# EAGLE schematic GaN_Fet_ESC_V0.1 (EAGLE 9.6.0)

## Sheet 1 of 2: Power Stage
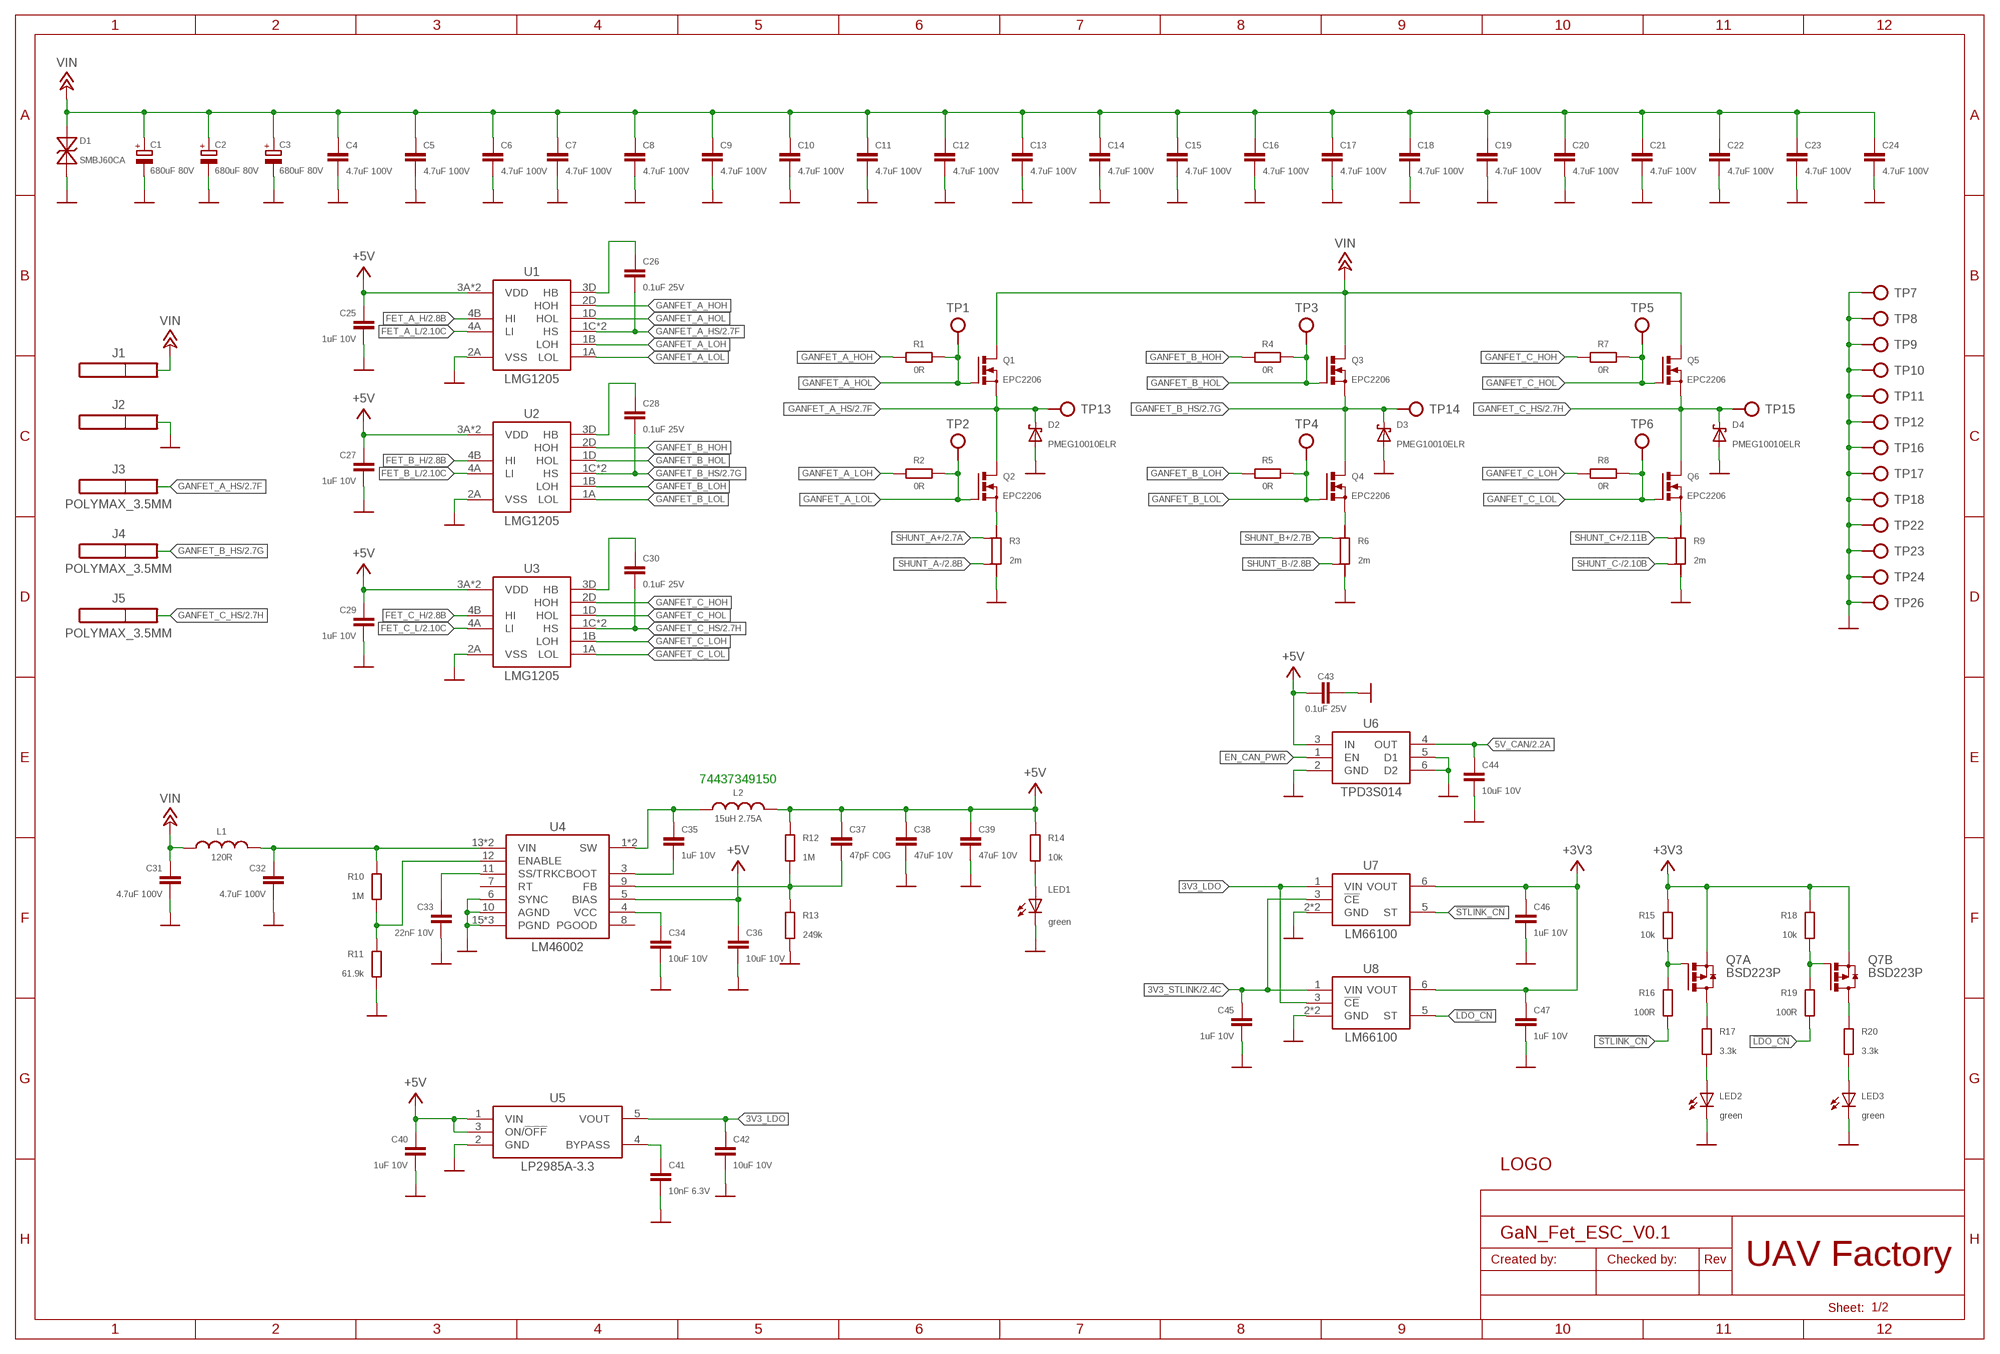
[diagram p0: schematic, sheet 1]

### Parts
C1  680uF 80V  CAPACITOR_ELECTROLYTIC1  [C_7.50_16_26.5_1]
C2  680uF 80V  CAPACITOR_ELECTROLYTIC2  [C_7.50_16_26.5_2]
C3  680uF 80V  CAPACITOR_ELECTROLYTIC3  [C_7.50_16_26.5_3]
C4  4.7uF 100V  CAPACITOR_CERAMIC/1210  [C1210]
C5  4.7uF 100V  CAPACITOR_CERAMIC/1210  [C1210]
C6  4.7uF 100V  CAPACITOR_CERAMIC/1210  [C1210]
C7  4.7uF 100V  CAPACITOR_CERAMIC/1210  [C1210]
C8  4.7uF 100V  CAPACITOR_CERAMIC/1210  [C1210]
C9  4.7uF 100V  CAPACITOR_CERAMIC/1210  [C1210]
C10  4.7uF 100V  CAPACITOR_CERAMIC/1210  [C1210]
C11  4.7uF 100V  CAPACITOR_CERAMIC/1210  [C1210]
C12  4.7uF 100V  CAPACITOR_CERAMIC/1210  [C1210]
C13  4.7uF 100V  CAPACITOR_CERAMIC/1210  [C1210]
C14  4.7uF 100V  CAPACITOR_CERAMIC/1210  [C1210]
C15  4.7uF 100V  CAPACITOR_CERAMIC/1210  [C1210]
C16  4.7uF 100V  CAPACITOR_CERAMIC/1210  [C1210]
C17  4.7uF 100V  CAPACITOR_CERAMIC/1210  [C1210]
C18  4.7uF 100V  CAPACITOR_CERAMIC/1210  [C1210]
C19  4.7uF 100V  CAPACITOR_CERAMIC/1210  [C1210]
C20  4.7uF 100V  CAPACITOR_CERAMIC/1210  [C1210]
C21  4.7uF 100V  CAPACITOR_CERAMIC/1210  [C1210]
C22  4.7uF 100V  CAPACITOR_CERAMIC/1210  [C1210]
C23  4.7uF 100V  CAPACITOR_CERAMIC/1210  [C1210]
C24  4.7uF 100V  CAPACITOR_CERAMIC/1210  [C1210]
C25  1uF 10V  CAPACITOR_CERAMIC/0402  [C0402]
C26  0.1uF 25V  CAPACITOR_CERAMIC/0402  [C0402]
C27  1uF 10V  CAPACITOR_CERAMIC/0402  [C0402]
C28  0.1uF 25V  CAPACITOR_CERAMIC/0402  [C0402]
C29  1uF 10V  CAPACITOR_CERAMIC/0402  [C0402]
C30  0.1uF 25V  CAPACITOR_CERAMIC/0402  [C0402]
C31  4.7uF 100V  CAPACITOR_CERAMIC/1210  [C1210]
C32  4.7uF 100V  CAPACITOR_CERAMIC/1210  [C1210]
C33  22nF 10V  CAPACITOR_CERAMIC/0402  [C0402]
C34  10uF 10V  CAPACITOR_CERAMIC/0603  [C0603]
C35  1uF 10V  CAPACITOR_CERAMIC/0402  [C0402]
C36  10uF 10V  CAPACITOR_CERAMIC/0603  [C0603]
C37  47pF C0G  CAPACITOR_CERAMIC/0402  [C0402]
C38  47uF 10V  CAPACITOR_CERAMIC/1206  [C1206]
C39  47uF 10V  CAPACITOR_CERAMIC/1206  [C1206]
C40  1uF 10V  CAPACITOR_CERAMIC/0402  [C0402]
C41  10nF 6.3V  CAPACITOR_CERAMIC/0402  [C0402]
C42  10uF 10V  CAPACITOR_CERAMIC/0603  [C0603]
C43  0.1uF 25V  CAPACITOR_CERAMIC/0402  [C0402]
C44  10uF 10V  CAPACITOR_CERAMIC/0603  [C0603]
C45  1uF 10V  CAPACITOR_CERAMIC/0402  [C0402]
C46  1uF 10V  CAPACITOR_CERAMIC/0402  [C0402]
C47  1uF 10V  CAPACITOR_CERAMIC/0402  [C0402]
D1  SMBJ60CA  DIODE_TVS_BIDIR/SMB  [DO214AA(SMB)]
D2  PMEG10010ELR  DIODE_SCHOTTKY/SOD123  [SOD123F]
D3  PMEG10010ELR  DIODE_SCHOTTKY/SOD123  [SOD123F]
D4  PMEG10010ELR  DIODE_SCHOTTKY/SOD123  [SOD123F]
J1  PIN_14X10  [4X10SMD]
J2  PIN_14X10  [4X10SMD]
J3  POLYMAX_3.5MM  [POLYMAX_3.5MM]
J4  POLYMAX_3.5MM  [POLYMAX_3.5MM]
J5  POLYMAX_3.5MM  [POLYMAX_3.5MM]
L1  120R  INDUCTOR/1206  [L1206]
L2  15uH 2.75A  INDUCTOR/WE-LHMI  [WURTH_6.6X6.6]
LED1  green  LED/0603  [CHIP-LED0603]
LED2  green  LED/0603  [CHIP-LED0603]
LED3  green  LED/0603  [CHIP-LED0603]
Q1  EPC2206  GAN-N-FET  [EPC2206]
Q2  EPC2206  GAN-N-FET  [EPC2206]
Q3  EPC2206  GAN-N-FET  [EPC2206]
Q4  EPC2206  GAN-N-FET  [EPC2206]
Q5  EPC2206  GAN-N-FET  [EPC2206]
Q6  EPC2206  GAN-N-FET  [EPC2206]
Q7  BSD223P  P-FET  [SC-70-6]
R1  0R  RESISTOR_SMD/0402  [R0402]
R2  0R  RESISTOR_SMD/0402  [R0402]
R3  2m  RESISTOR_KELVIN/CRF2512  [CSS2H-2512]
R4  0R  RESISTOR_SMD/0402  [R0402]
R5  0R  RESISTOR_SMD/0402  [R0402]
R6  2m  RESISTOR_KELVIN/CRF2512  [CSS2H-2512]
R7  0R  RESISTOR_SMD/0402  [R0402]
R8  0R  RESISTOR_SMD/0402  [R0402]
R9  2m  RESISTOR_KELVIN/CRF2512  [CSS2H-2512]
R10  1M  RESISTOR_SMD/0603  [R0603]
R11  61.9k  RESISTOR_SMD/0603  [R0603]
R12  1M  RESISTOR_SMD/0402  [R0402]
R13  249k  RESISTOR_SMD/0402  [R0402]
R14  10k  RESISTOR_SMD/0402  [R0402]
R15  10k  RESISTOR_SMD/0402  [R0402]
R16  100R  RESISTOR_SMD/0402  [R0402]
R17  3.3k  RESISTOR_SMD/0402  [R0402]
R18  10k  RESISTOR_SMD/0402  [R0402]
R19  100R  RESISTOR_SMD/0402  [R0402]
R20  3.3k  RESISTOR_SMD/0402  [R0402]
TP1  TESTPOINT/0.9MM  [0.9MM]
TP2  TESTPOINT/0.9MM  [0.9MM]
TP3  TESTPOINT/0.9MM  [0.9MM]
TP4  TESTPOINT/0.9MM  [0.9MM]
TP5  TESTPOINT/0.9MM  [0.9MM]
TP6  TESTPOINT/0.9MM  [0.9MM]
TP7  TESTPOINT0.5MM  [0.5MM]
TP8  TESTPOINT0.5MM  [0.5MM]
TP9  TESTPOINT0.5MM  [0.5MM]
TP10  TESTPOINT0.5MM  [0.5MM]
TP11  TESTPOINT0.5MM  [0.5MM]
TP12  TESTPOINT0.5MM  [0.5MM]
TP13  TESTPOINT/0.9MM  [0.9MM]
TP14  TESTPOINT/0.9MM  [0.9MM]
TP15  TESTPOINT/0.9MM  [0.9MM]
TP16  TESTPOINT0.5MM  [0.5MM]
TP17  TESTPOINT0.5MM  [0.5MM]
TP18  TESTPOINT0.5MM  [0.5MM]
TP22  TESTPOINT0.5MM  [0.5MM]
TP23  TESTPOINT0.5MM  [0.5MM]
TP24  TESTPOINT0.5MM  [0.5MM]
TP26  TESTPOINT0.5MM  [0.5MM]
U1  LMG1205  [LMG1205]
U2  LMG1205  [LMG1205]
U3  LMG1205  [LMG1205]
U4  LM46002  [TSS0P16-PAD]
U5  LP2985A-3.3  LP2985  [SOT-23-5]
U6  TPD3S014  [SOT-23-6]
U7  LM66100  [SC-70-6]
U8  LM66100  [SC-70-6]
U$1  LOGO  [LOGO]

### Nets
3V3_LDO: C42.1 U5.5(VOUT) U7.1(VIN) U8.3(!CE)
3V3_STLINK: C45.1 U7.3(!CE) U8.1(VIN) ; also sheet 2
5V_CAN: C44.1 U6.4(OUT) ; also sheet 2
5V_VCC: C34.1 U4.4(VCC)
5V_VIN: C32.1 L1.2 R10.2 U4.13(VIN) U4.14(VIN)
!LDO_CN: R19.1 U8.5(ST)
!STLINK_CN: R16.1 U7.5(ST)
+3V3: C46.1 C47.1 Q7.1(A:S) Q7.4(B:S) R15.2 R18.2 U7.6(VOUT) U8.6(VOUT) ; also sheet 2
+5V: C25.1 C27.1 C29.1 C36.1 C37.1 C38.1 C39.1 C40.1 C43.1 L2.2 R12.2 R14.2 U1.3A(VDD) U1.4C(VDD) U2.3A(VDD) U2.4C(VDD) U3.3A(VDD) U3.4C(VDD) U4.5(BIAS) U5.1(VIN) U5.3(ON/!OFF) U6.3(IN) ; also sheet 2
CBOOT: C35.2 U4.3(CBOOT)
EN_CAN_PWR: U6.1(EN)
ENABLE: R10.1 R11.2 U4.12(ENABLE)
FB: C37.2 R12.1 R13.2 U4.9(FB)
FET_A_H: U1.4B(HI) ; also sheet 2
FET_A_L: U1.4A(LI) ; also sheet 2
FET_B_H: U2.4B(HI) ; also sheet 2
FET_B_L: U2.4A(LI) ; also sheet 2
FET_C_H: U3.4B(HI) ; also sheet 2
FET_C_L: U3.4A(LI) ; also sheet 2
GANFET_A_HB: C26.1 U1.3D(HB)
GANFET_A_HOH: R1.1 U1.2D(HOH)
GANFET_A_HOL: Q1.1(G) R1.2 TP1.P$1 U1.1D(HOL)
GANFET_A_HS: C26.2 D2.C J3.1 Q1.2(S) Q1.5(S) Q1.6(S) Q1.9(S) Q1.10(S) Q1.13(S) Q1.14(S) Q1.17(S) Q1.18(S) Q1.21(S) Q1.22(S) Q1.25(S) Q1.26(S) Q1.29(S) Q1.30(S) Q2.3(D) Q2.4(D) Q2.7(D) Q2.8(D) Q2.11(D) Q2.12(D) Q2.15(D) Q2.16(D) Q2.19(D) Q2.20(D) Q2.23(D) Q2.24(D) Q2.27(D) Q2.28(D) TP13.P$1 U1.1C(HS) U1.4D(HS) ; also sheet 2
GANFET_A_LOH: R2.1 U1.1B(LOH)
GANFET_A_LOL: Q2.1(G) R2.2 TP2.P$1 U1.1A(LOL)
GANFET_A_SHUNT: Q2.2(S) Q2.5(S) Q2.6(S) Q2.9(S) Q2.10(S) Q2.13(S) Q2.14(S) Q2.17(S) Q2.18(S) Q2.21(S) Q2.22(S) Q2.25(S) Q2.26(S) Q2.29(S) Q2.30(S) R3.1
GANFET_B_HB: C28.1 U2.3D(HB)
GANFET_B_HOH: R4.1 U2.2D(HOH)
GANFET_B_HOL: Q3.1(G) R4.2 TP3.P$1 U2.1D(HOL)
GANFET_B_HS: C28.2 D3.C J4.1 Q3.2(S) Q3.5(S) Q3.6(S) Q3.9(S) Q3.10(S) Q3.13(S) Q3.14(S) Q3.17(S) Q3.18(S) Q3.21(S) Q3.22(S) Q3.25(S) Q3.26(S) Q3.29(S) Q3.30(S) Q4.3(D) Q4.4(D) Q4.7(D) Q4.8(D) Q4.11(D) Q4.12(D) Q4.15(D) Q4.16(D) Q4.19(D) Q4.20(D) Q4.23(D) Q4.24(D) Q4.27(D) Q4.28(D) TP14.P$1 U2.1C(HS) U2.4D(HS) ; also sheet 2
GANFET_B_LOH: R5.1 U2.1B(LOH)
GANFET_B_LOL: Q4.1(G) R5.2 TP4.P$1 U2.1A(LOL)
GANFET_B_SHUNT: Q4.2(S) Q4.5(S) Q4.6(S) Q4.9(S) Q4.10(S) Q4.13(S) Q4.14(S) Q4.17(S) Q4.18(S) Q4.21(S) Q4.22(S) Q4.25(S) Q4.26(S) Q4.29(S) Q4.30(S) R6.1
GANFET_C_HB: C30.1 U3.3D(HB)
GANFET_C_HOH: R7.1 U3.2D(HOH)
GANFET_C_HOL: Q5.1(G) R7.2 TP5.P$1 U3.1D(HOL)
GANFET_C_HS: C30.2 D4.C J5.1 Q5.2(S) Q5.5(S) Q5.6(S) Q5.9(S) Q5.10(S) Q5.13(S) Q5.14(S) Q5.17(S) Q5.18(S) Q5.21(S) Q5.22(S) Q5.25(S) Q5.26(S) Q5.29(S) Q5.30(S) Q6.3(D) Q6.4(D) Q6.7(D) Q6.8(D) Q6.11(D) Q6.12(D) Q6.15(D) Q6.16(D) Q6.19(D) Q6.20(D) Q6.23(D) Q6.24(D) Q6.27(D) Q6.28(D) TP15.P$1 U3.1C(HS) U3.4D(HS) ; also sheet 2
GANFET_C_LOH: R8.1 U3.1B(LOH)
GANFET_C_LOL: Q6.1(G) R8.2 TP6.P$1 U3.1A(LOL)
GANFET_C_SHUNT: Q6.2(S) Q6.5(S) Q6.6(S) Q6.9(S) Q6.10(S) Q6.13(S) Q6.14(S) Q6.17(S) Q6.18(S) Q6.21(S) Q6.22(S) Q6.25(S) Q6.26(S) Q6.29(S) Q6.30(S) R9.1
GND: C1.- C2.- C3.- C4.2 C5.2 C6.2 C7.2 C8.2 C9.2 C10.2 C11.2 C12.2 C13.2 C14.2 C15.2 C16.2 C17.2 C18.2 C19.2 C20.2 C21.2 C22.2 C23.2 C24.2 C25.2 C27.2 C29.2 C31.2 C32.2 C33.2 C34.2 C36.2 C38.2 C39.2 C40.2 C41.2 C42.2 C43.2 C44.2 C45.2 C46.2 C47.2 D1.K(C) D2.A D3.A D4.A J2.1 LED1.C LED2.C LED3.C R3.2 R6.2 R9.2 R11.1 R13.1 TP7.P$1 TP8.P$1 TP9.P$1 TP10.P$1 TP11.P$1 TP12.P$1 TP16.P$1 TP17.P$1 TP18.P$1 TP22.P$1 TP23.P$1 TP24.P$1 TP26.P$1 U1.2A(VSS) U2.2A(VSS) U3.2A(VSS) U4.6(SYNC) U4.10(AGND) U4.15(PGND) U4.16(PGND) U4.PAD(PGND) U5.2(GND) U6.2(GND) U6.5(D1) U6.6(D2) U7.2(GND) U7.4(GND) U8.2(GND) U8.4(GND) ; also sheet 2
LDO_BYPASS: C41.1 U5.4(BYPASS)
N$2: LED3.A R20.1
N$4: LED2.A R17.1
N$5: LED1.A R14.1
N$17: Q7.3(A:D) R17.2
N$18: Q7.6(B:D) R20.2
N$19: Q7.2(A:G) R15.1 R16.2
N$22: Q7.5(B:G) R18.1 R19.2
SHUNT_A+: R3.1_SENSE(1K) ; also sheet 2
SHUNT_A-: R3.2_SENSE(2K) ; also sheet 2
SHUNT_B+: R6.1_SENSE(1K) ; also sheet 2
SHUNT_B-: R6.2_SENSE(2K) ; also sheet 2
SHUNT_C+: R9.1_SENSE(1K) ; also sheet 2
SHUNT_C-: R9.2_SENSE(2K) ; also sheet 2
SS: C33.1 U4.11(SS/TRK)
SW: C35.1 L2.1 U4.1(SW) U4.2(SW)
VIN: C1.+ C2.+ C3.+ C4.1 C5.1 C6.1 C7.1 C8.1 C9.1 C10.1 C11.1 C12.1 C13.1 C14.1 C15.1 C16.1 C17.1 C18.1 C19.1 C20.1 C21.1 C22.1 C23.1 C24.1 C31.1 D1.A J1.1 L1.1 Q1.3(D) Q1.4(D) Q1.7(D) Q1.8(D) Q1.11(D) Q1.12(D) Q1.15(D) Q1.16(D) Q1.19(D) Q1.20(D) Q1.23(D) Q1.24(D) Q1.27(D) Q1.28(D) Q3.3(D) Q3.4(D) Q3.7(D) Q3.8(D) Q3.11(D) Q3.12(D) Q3.15(D) Q3.16(D) Q3.19(D) Q3.20(D) Q3.23(D) Q3.24(D) Q3.27(D) Q3.28(D) Q5.3(D) Q5.4(D) Q5.7(D) Q5.8(D) Q5.11(D) Q5.12(D) Q5.15(D) Q5.16(D) Q5.19(D) Q5.20(D) Q5.23(D) Q5.24(D) Q5.27(D) Q5.28(D) ; also sheet 2
Unconnected: U4.7(RT) U4.8(PGOOD)

### Notes on the sheet
- 74437349150

## Sheet 2 of 2: Signal Processing
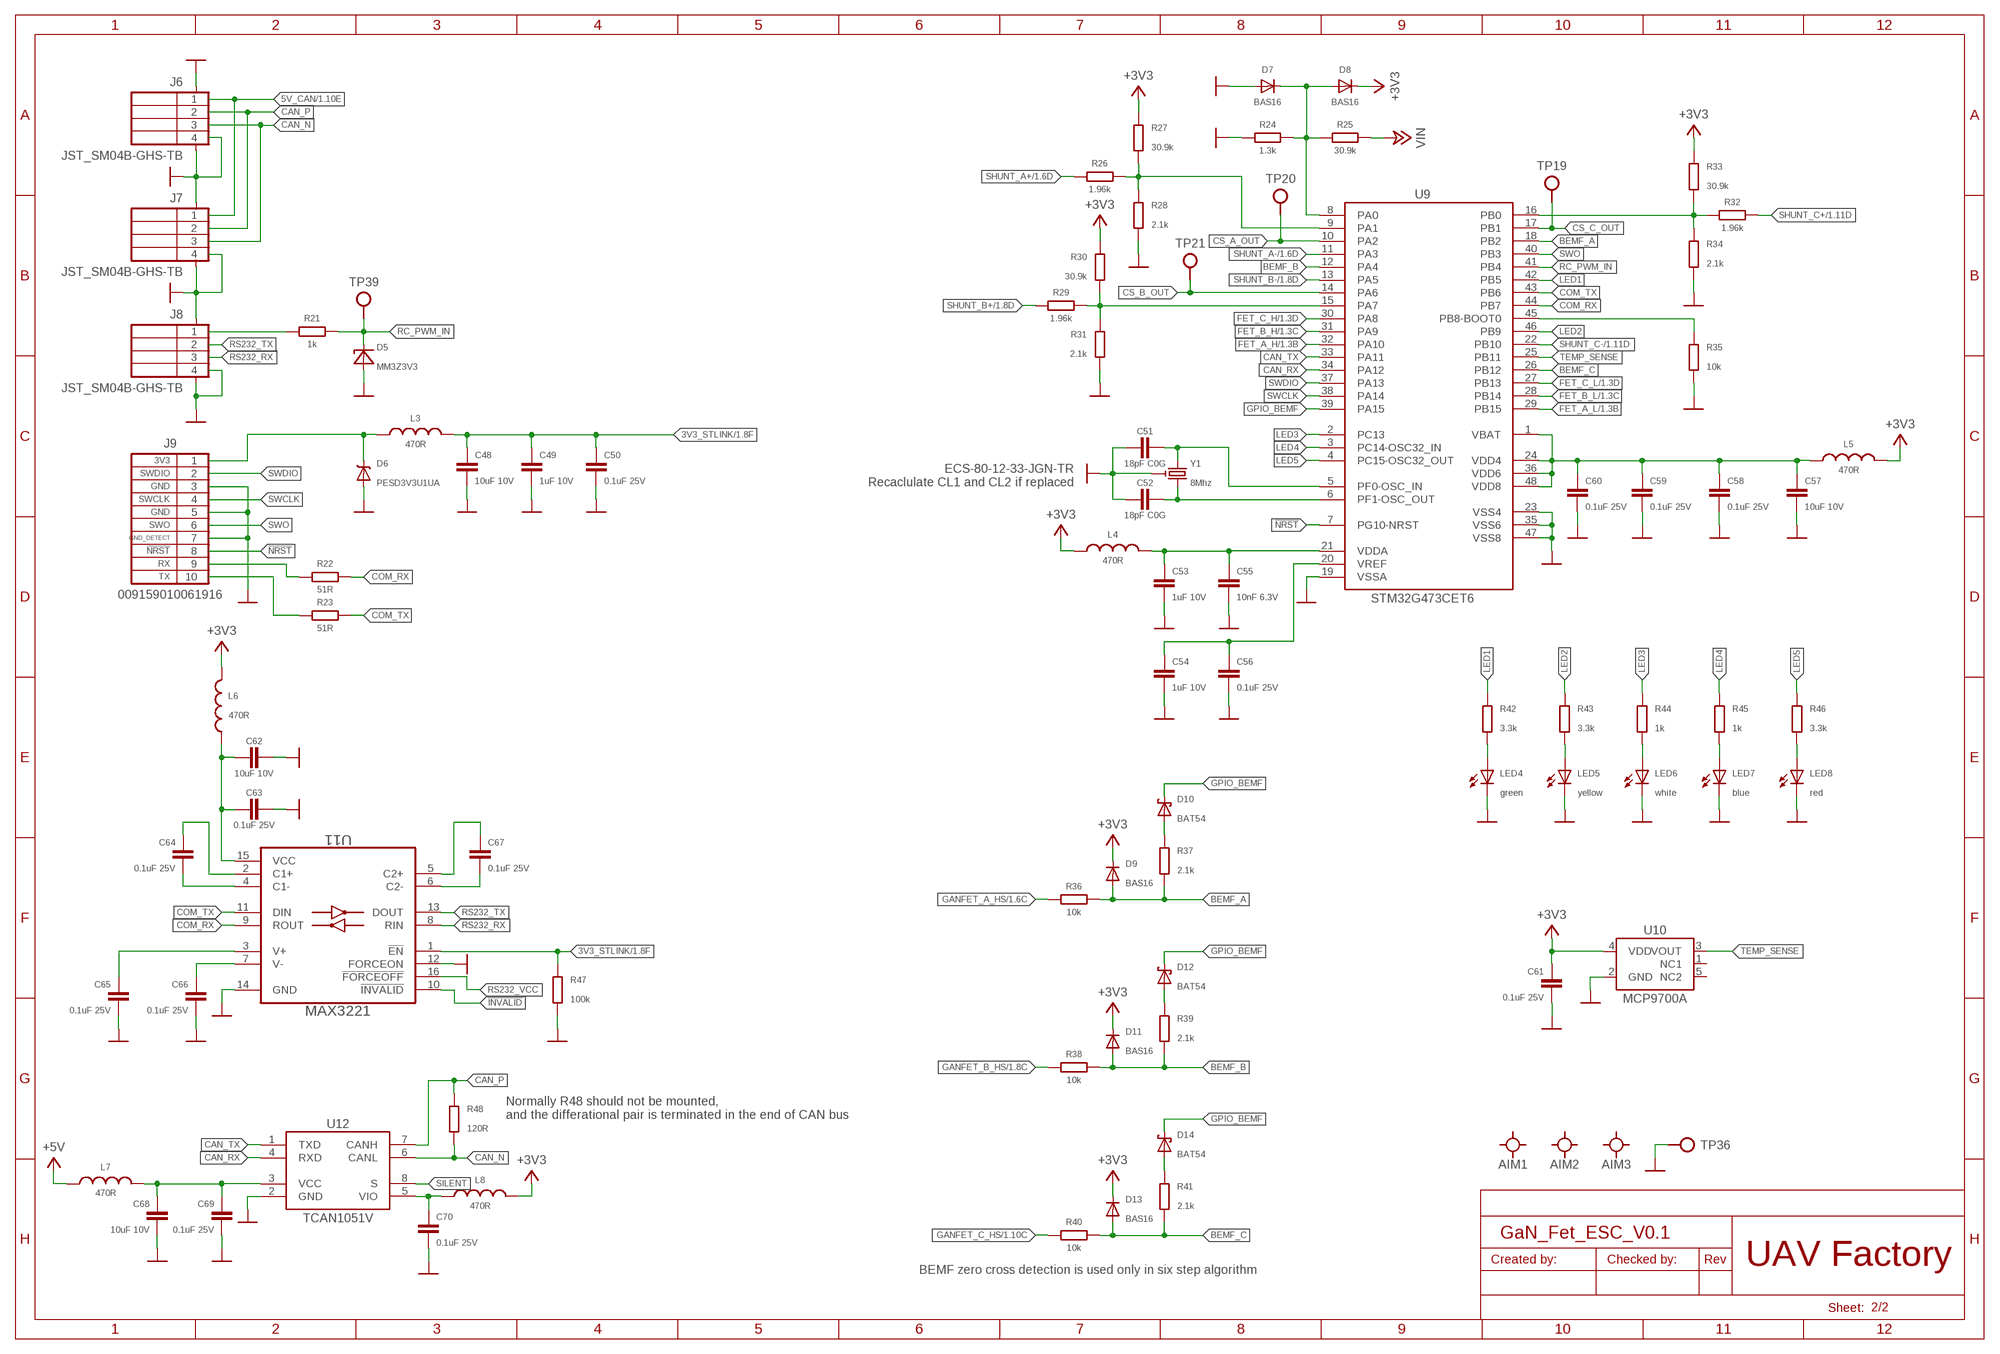
[diagram p1: schematic, sheet 2]

### Parts
AIM1  AIM_1_MM  [AIM_1_MM]
AIM2  AIM_1_MM  [AIM_1_MM]
AIM3  AIM_1_MM  [AIM_1_MM]
C48  10uF 10V  CAPACITOR_CERAMIC/0603  [C0603]
C49  1uF 10V  CAPACITOR_CERAMIC/0402  [C0402]
C50  0.1uF 25V  CAPACITOR_CERAMIC/0402  [C0402]
C51  18pF C0G  CAPACITOR_CERAMIC/0402  [C0402]
C52  18pF C0G  CAPACITOR_CERAMIC/0402  [C0402]
C53  1uF 10V  CAPACITOR_CERAMIC/0402  [C0402]
C54  1uF 10V  CAPACITOR_CERAMIC/0402  [C0402]
C55  10nF 6.3V  CAPACITOR_CERAMIC/0402  [C0402]
C56  0.1uF 25V  CAPACITOR_CERAMIC/0402  [C0402]
C57  10uF 10V  CAPACITOR_CERAMIC/0603  [C0603]
C58  0.1uF 25V  CAPACITOR_CERAMIC/0402  [C0402]
C59  0.1uF 25V  CAPACITOR_CERAMIC/0402  [C0402]
C60  0.1uF 25V  CAPACITOR_CERAMIC/0402  [C0402]
C61  0.1uF 25V  CAPACITOR_CERAMIC/0402  [C0402]
C62  10uF 10V  CAPACITOR_CERAMIC/0603  [C0603]
C63  0.1uF 25V  CAPACITOR_CERAMIC/0402  [C0402]
C64  0.1uF 25V  CAPACITOR_CERAMIC/0402  [C0402]
C65  0.1uF 25V  CAPACITOR_CERAMIC/0402  [C0402]
C66  0.1uF 25V  CAPACITOR_CERAMIC/0402  [C0402]
C67  0.1uF 25V  CAPACITOR_CERAMIC/0402  [C0402]
C68  10uF 10V  CAPACITOR_CERAMIC/0603  [C0603]
C69  0.1uF 25V  CAPACITOR_CERAMIC/0402  [C0402]
C70  0.1uF 25V  CAPACITOR_CERAMIC/0402  [C0402]
D5  MM3Z3V3  DIODE_ZENER  [SOD323F]
D6  PESD3V3U1UA  DIODE_TVS_UNIDIR/SOD323  [SOD323F]
D7  BAS16  DIODE/SOD523  [SOD523]
D8  BAS16  DIODE/SOD523  [SOD523]
D9  BAS16  DIODE/SOD523  [SOD523]
D10  BAT54  DIODE_SCHOTTKY/SOD523  [SOD523]
D11  BAS16  DIODE/SOD523  [SOD523]
D12  BAT54  DIODE_SCHOTTKY/SOD523  [SOD523]
D13  BAS16  DIODE/SOD523  [SOD523]
D14  BAT54  DIODE_SCHOTTKY/SOD523  [SOD523]
J6  JST_SM04B-GHS-TB  [JST_SM04B-GHS-TB]
J7  JST_SM04B-GHS-TB  [JST_SM04B-GHS-TB]
J8  JST_SM04B-GHS-TB  [JST_SM04B-GHS-TB]
J9  009159010061916  [009159010061916]
L3  470R  INDUCTOR/0603  [L0603]
L4  470R  INDUCTOR/0603  [L0603]
L5  470R  INDUCTOR/0603  [L0603]
L6  470R  INDUCTOR/0603  [L0603]
L7  470R  INDUCTOR/0603  [L0603]
L8  470R  INDUCTOR/0603  [L0603]
LED4  green  LED/0603  [CHIP-LED0603]
LED5  yellow  LED/0603  [CHIP-LED0603]
LED6  white  LED/0603  [CHIP-LED0603]
LED7  blue  LED/0603  [CHIP-LED0603]
LED8  red  LED/0603  [CHIP-LED0603]
R21  1k  RESISTOR_SMD/0402  [R0402]
R22  51R  RESISTOR_SMD/0402  [R0402]
R23  51R  RESISTOR_SMD/0402  [R0402]
R24  1.3k  RESISTOR_SMD/0603  [R0603]
R25  30.9k  RESISTOR_SMD/0603  [R0603]
R26  1.96k  RESISTOR_SMD/0402  [R0402]
R27  30.9k  RESISTOR_SMD/0402  [R0402]
R28  2.1k  RESISTOR_SMD/0402  [R0402]
R29  1.96k  RESISTOR_SMD/0402  [R0402]
R30  30.9k  RESISTOR_SMD/0402  [R0402]
R31  2.1k  RESISTOR_SMD/0402  [R0402]
R32  1.96k  RESISTOR_SMD/0402  [R0402]
R33  30.9k  RESISTOR_SMD/0402  [R0402]
R34  2.1k  RESISTOR_SMD/0402  [R0402]
R35  10k  RESISTOR_SMD/0402  [R0402]
R36  10k  RESISTOR_SMD/0402  [R0402]
R37  2.1k  RESISTOR_SMD/0402  [R0402]
R38  10k  RESISTOR_SMD/0402  [R0402]
R39  2.1k  RESISTOR_SMD/0402  [R0402]
R40  10k  RESISTOR_SMD/0402  [R0402]
R41  2.1k  RESISTOR_SMD/0402  [R0402]
R42  3.3k  RESISTOR_SMD/0402  [R0402]
R43  3.3k  RESISTOR_SMD/0402  [R0402]
R44  1k  RESISTOR_SMD/0402  [R0402]
R45  1k  RESISTOR_SMD/0402  [R0402]
R46  3.3k  RESISTOR_SMD/0402  [R0402]
R47  100k  RESISTOR_SMD/0402  [R0402]
R48  120R  RESISTOR_SMD/0805  [R0805]
TP19  TESTPOINT/0.9MM  [0.9MM]
TP20  TESTPOINT/0.9MM  [0.9MM]
TP21  TESTPOINT/0.9MM  [0.9MM]
TP36  TESTPOINT0.5MM  [0.5MM]
TP39  TESTPOINT/0.9MM  [0.9MM]
U9  STM32G473CET6  STM32G4_48  [LQFP-48]
U10  MCP9700A  MCP9700  [SC-70-5]
U11  MAX3221  [TSS0P16]
U12  TCAN1051V  [SOIC-8]
Y1  8Mhz  CRYSTAL_GROUNDED/SMD_3.2X2.5MM  [CRYSTAL_SMD_3.2X2.5MM]

### Nets
3V3_STLINK: C48.1 C49.1 C50.1 L3.1 R47.2 U11.1(!EN) ; also sheet 1
5V_CAN: J6.1 J7.1 ; also sheet 1
!INVALID: U11.10(!INVALID)
!NRST: J9.8 U9.7(PG10-NRST)
+3V3: C61.1 D8.C D9.C D11.C D13.C L4.1 L5.2 L6.1 L8.2 R27.2 R30.2 R33.2 U10.4(VDD) ; also sheet 1
+5V: L7.1 ; also sheet 1
BEMF_A: D9.A R36.2 R37.1 U9.18(PB2)
BEMF_B: D11.A R38.2 R39.1 U9.12(PA4)
BEMF_C: D13.A R40.2 R41.1 U9.26(PB12)
BOOT0: R35.2 U9.45(PB8-BOOT0)
C1+: C64.1 U11.2(C1+)
C1-: C64.2 U11.4(C1-)
C2+: C67.1 U11.5(C2+)
C2-: C67.2 U11.6(C2-)
CAN_N: J6.3 J7.3 R48.1 U12.6(CANL)
CAN_P: J6.2 J7.2 R48.2 U12.7(CANH)
CAN_RX: U9.34(PA12) U12.4(RXD)
CAN_TX: U9.33(PA11) U12.1(TXD)
CAN_VCC: C68.1 C69.1 L7.2 U12.3(VCC)
CAN_VIO: C70.1 L8.1 U12.5(VIO)
COM_RX: R22.1 U9.44(PB7) U11.9(ROUT)
COM_TX: R23.1 U9.43(PB6) U11.11(DIN)
CS_A_OUT: TP20.P$1 U9.10(PA2)
CS_B_OUT: TP21.P$1 U9.14(PA6)
CS_C_OUT: TP19.P$1 U9.17(PB1)
FET_A_H: U9.32(PA10) ; also sheet 1
FET_A_L: U9.29(PB15) ; also sheet 1
FET_B_H: U9.31(PA9) ; also sheet 1
FET_B_L: U9.28(PB14) ; also sheet 1
FET_C_H: U9.30(PA8) ; also sheet 1
FET_C_L: U9.27(PB13) ; also sheet 1
GANFET_A_HS: R36.1 ; also sheet 1
GANFET_B_HS: R38.1 ; also sheet 1
GANFET_C_HS: R40.1 ; also sheet 1
GND: C48.2 C49.2 C50.2 C51.1 C52.1 C53.2 C54.2 C55.2 C56.2 C57.2 C58.2 C59.2 C60.2 C61.2 C62.2 C63.2 C65.2 C66.2 C68.2 C69.2 C70.2 D5.A D6.A D7.A J6.4 J6.5 J6.6 J7.4 J7.5 J7.6 J8.4 J8.5 J8.6 J9.3 J9.5 J9.7 LED4.C LED5.C LED6.C LED7.C LED8.C R24.1 R28.1 R31.1 R34.1 R35.1 R47.1 TP36.P$1 U9.19(VSSA) U9.23(VSS4) U9.35(VSS6) U9.47(VSS8) U10.2(GND) U11.12(FORCEON) U11.14(GND) U12.2(GND) Y1.2 Y1.4 ; also sheet 1
GPIO_BEMF: D10.C D12.C D14.C U9.39(PA15)
LED1: R42.2 U9.42(PB5)
LED2: R43.2 U9.46(PB9)
LED3: R44.2 U9.2(PC13)
LED4: R45.2 U9.3(PC14-OSC32_IN)
LED5: R46.2 U9.4(PC15-OSC32_OUT)
MCU_VDD: C57.1 C58.1 C59.1 C60.1 L5.1 U9.1(VBAT) U9.24(VDD4) U9.36(VDD6) U9.48(VDD8)
MCU_VDDA: C53.1 C55.1 L4.2 U9.21(VDDA)
MCU_VREF: C54.1 C56.1 U9.20(VREF)
N$1: LED5.A R43.1
N$3: J9.9 R22.2
N$6: LED4.A R42.1
N$7: LED7.A R45.1
N$8: LED8.A R46.1
N$9: J8.1 R21.2
N$10: D12.A R39.2
N$11: C51.2 U9.5(PF0-OSC_IN) Y1.1
N$12: C52.2 U9.6(PF1-OSC_OUT) Y1.3
N$13: D10.A R37.2
N$14: D14.A R41.2
N$15: D6.C J9.1 L3.2
N$16: J9.10 R23.2
N$137: LED6.A R44.1
OPAMP1+: R26.2 R27.1 R28.2 U9.9(PA1)
OPAMP2+: R29.2 R30.1 R31.2 U9.15(PA7)
OPAMP3+: R32.2 R33.1 R34.2 U9.16(PB0)
RC_PWM_IN: D5.C R21.1 TP39.P$1 U9.41(PB4)
RS232_RX: J8.3 U11.8(RIN)
RS232_TX: J8.2 U11.13(DOUT)
RS232_VCC: C62.1 C63.1 L6.2 U11.15(VCC) U11.16(!FORCEOFF)
SHUNT_A+: R26.1 ; also sheet 1
SHUNT_A-: U9.11(PA3) ; also sheet 1
SHUNT_B+: R29.1 ; also sheet 1
SHUNT_B-: U9.13(PA5) ; also sheet 1
SHUNT_C+: R32.1 ; also sheet 1
SHUNT_C-: U9.22(PB10) ; also sheet 1
SILENT: U12.8(S)
SWCLK: J9.4 U9.38(PA14)
SWDIO: J9.2 U9.37(PA13)
SWO: J9.6 U9.40(PB3)
TEMP_SENSE: U9.25(PB11) U10.3(VOUT)
V+: C65.1 U11.3(V+)
V-: C66.1 U11.7(V-)
VIN: R25.2 ; also sheet 1
VIN_SENSE: D7.C D8.A R24.2 R25.1 U9.8(PA0)
Unconnected: AIM1.AIM AIM2.AIM AIM3.AIM U10.1(NC1) U10.5(NC2)

### Notes on the sheet
- 3V3
- SWDIO
- GND
- ECS-80-12-33-JGN-TR
  Recaclulate CL1 and CL2 if replaced
- SWCLK
- GND
- SWO
- GND_DETECT
- !NRST
- RX
- TX
- Normally R48 should not be mounted,
  and the differational pair is terminated in the end of CAN bus
- BEMF zero cross detection is used only in six step algorithm

## Library data of the parts
AIM1-AIM3 = ESC:AIM_1_MM
C1-C3 = ESC:CAPACITOR_ELECTROLYTIC
C4-C70 = ESC:CAPACITOR_CERAMIC
D1 = ESC:DIODE_TVS_BIDIR
D2-D4 D10 D12 D14 = ESC:DIODE_SCHOTTKY
D5 = ESC:DIODE_ZENER
D6 = ESC:DIODE_TVS_UNIDIR
D7-D9 D11 D13 = ESC:DIODE
J1 J2 = ESC:PIN_1
J3-J5 = ESC:POLYMAX_3.5MM
J6-J8 = ESC:JST_SM04B-GHS-TB
J9 = ESC:009159010061916
L1-L8 = ESC:INDUCTOR
LED1-LED8 = ESC:LED
Q1-Q6 = ESC:GAN-N-FET
Q7 = ESC:P-FET
R1 R2 R4 R5 R7 R8 R10-R48 = ESC:RESISTOR_SMD
R3 R6 R9 = ESC:RESISTOR_KELVIN
TP1-TP24 TP26 TP36 TP39 = ESC:TESTPOINT
U1-U3 = ESC:LMG1205
U4 = ESC:LM46002
U5 = ESC:LP2985
U6 = ESC:TPD3S014
U7 U8 = ESC:LM66100
U9 = ESC:STM32G4_48
U10 = ESC:MCP9700
U11 = ESC:MAX3221
U12 = ESC:TCAN1051V
U$1 = ESC:LOGO
Y1 = ESC:CRYSTAL_GROUNDED